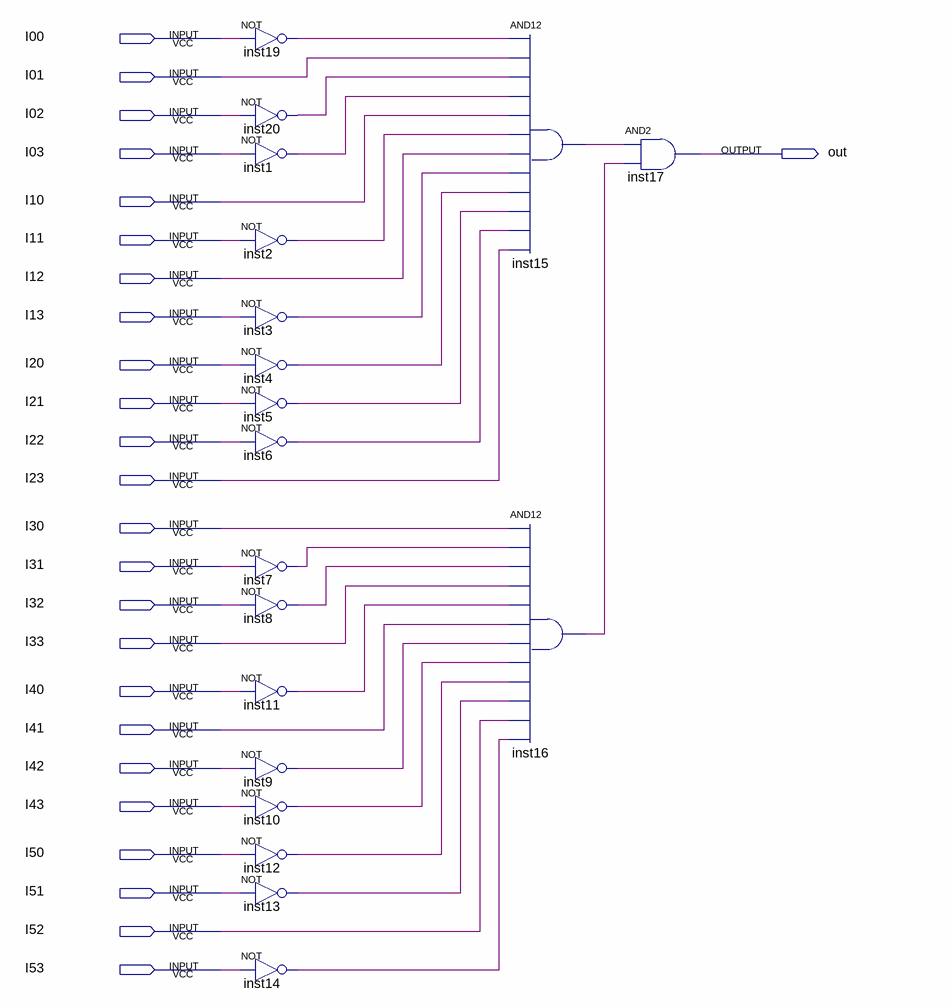
[diagram p0: schematic sheet]
// Quartus schematic comparador.bdf as structural Verilog: 19 symbols, 25 pins
module comparador (
  input  I00,
  input  I01,
  input  I02,
  input  I03,
  input  I10,
  input  I11,
  input  I12,
  input  I13,
  input  I20,
  input  I21,
  input  I22,
  input  I23,
  input  I30,
  input  I31,
  input  I32,
  input  I33,
  input  I40,
  input  I41,
  input  I42,
  input  I43,
  input  I50,
  input  I51,
  input  I52,
  input  I53,
  output out
);

  wire inst1_out, inst2_out, inst3_out, inst4_out, inst5_out, inst6_out, inst7_out, inst8_out, inst9_out,
       inst10_out, inst11_out, inst12_out, inst13_out, inst14_out, inst15_out, inst16_out, inst19_out,
       inst20_out;

  not inst19 (inst19_out, I00);
  not inst20 (inst20_out, I02);
  not inst1 (inst1_out, I03);
  not inst2 (inst2_out, I11);
  not inst3 (inst3_out, I13);
  not inst4 (inst4_out, I20);
  not inst5 (inst5_out, I21);
  not inst6 (inst6_out, I22);
  not inst7 (inst7_out, I31);
  not inst8 (inst8_out, I32);
  not inst11 (inst11_out, I40);
  not inst9 (inst9_out, I42);
  not inst10 (inst10_out, I43);
  not inst12 (inst12_out, I50);
  not inst13 (inst13_out, I51);
  not inst14 (inst14_out, I53);
  and inst15 (inst15_out, inst19_out, I01, inst20_out, inst1_out, I10, inst2_out, I12, inst3_out, inst4_out, inst5_out, inst6_out, I23);
  and inst16 (inst16_out, I30, inst7_out, inst8_out, I33, inst11_out, I41, inst9_out, inst10_out, inst12_out, inst13_out, I52, inst14_out);
  and inst17 (out, inst15_out, inst16_out);
endmodule
